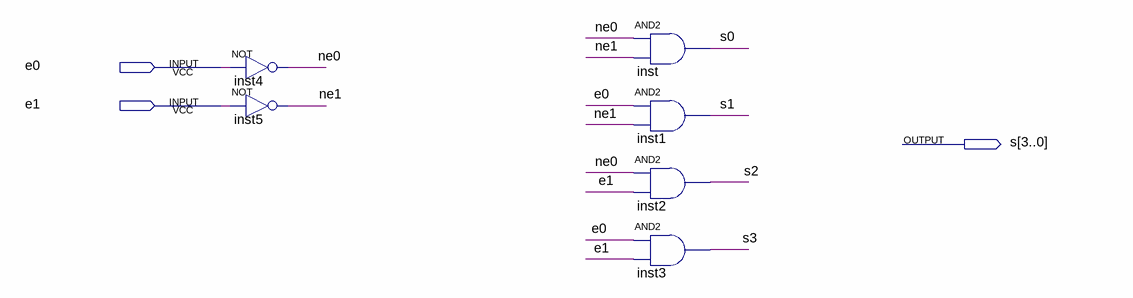
[diagram p0: schematic sheet]
// Quartus schematic decodificador2x4.bdf as structural Verilog: 6 symbols, 3 pins
module decodificador2x4 (
  input  e0,
  input  e1,
  output [3:0] s
);

  wire ne0, ne1;

  not inst4 (ne0, e0);
  not inst5 (ne1, e1);
  and inst (s[0], ne0, ne1);
  and inst1 (s[1], e0, ne1);
  and inst2 (s[2], ne0, e1);
  and inst3 (s[3], e0, e1);
endmodule
